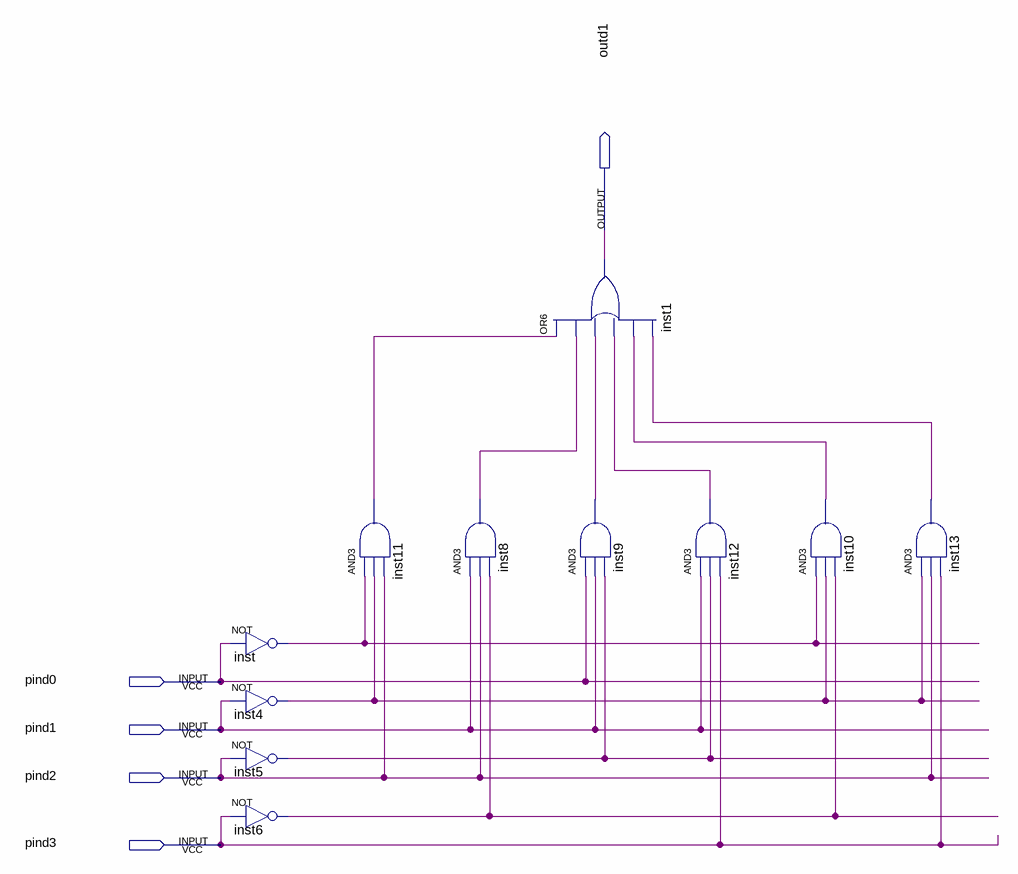
[diagram p0: schematic sheet]
// Quartus schematic OriginalD.bdf as structural Verilog: 11 symbols, 5 pins
module OriginalD (
  input  pind0,
  input  pind1,
  input  pind2,
  input  pind3,
  output outd1
);

  wire inst4_out, inst5_out, inst6_out, inst8_out, inst9_out, inst10_out, inst11_out, inst12_out, inst13_out,
       inst_out;

  not inst (inst_out, pind0);
  not inst4 (inst4_out, pind1);
  not inst5 (inst5_out, pind2);
  not inst6 (inst6_out, pind3);
  and inst11 (inst11_out, inst_out, inst4_out, pind2);
  and inst8 (inst8_out, pind1, pind2, inst6_out);
  or inst1 (outd1, inst11_out, inst8_out, inst9_out, inst12_out, inst10_out, inst13_out);
  and inst9 (inst9_out, pind0, pind1, inst5_out);
  and inst12 (inst12_out, pind1, inst5_out, pind3);
  and inst10 (inst10_out, inst_out, inst4_out, inst6_out);
  and inst13 (inst13_out, inst4_out, pind2, pind3);
endmodule
